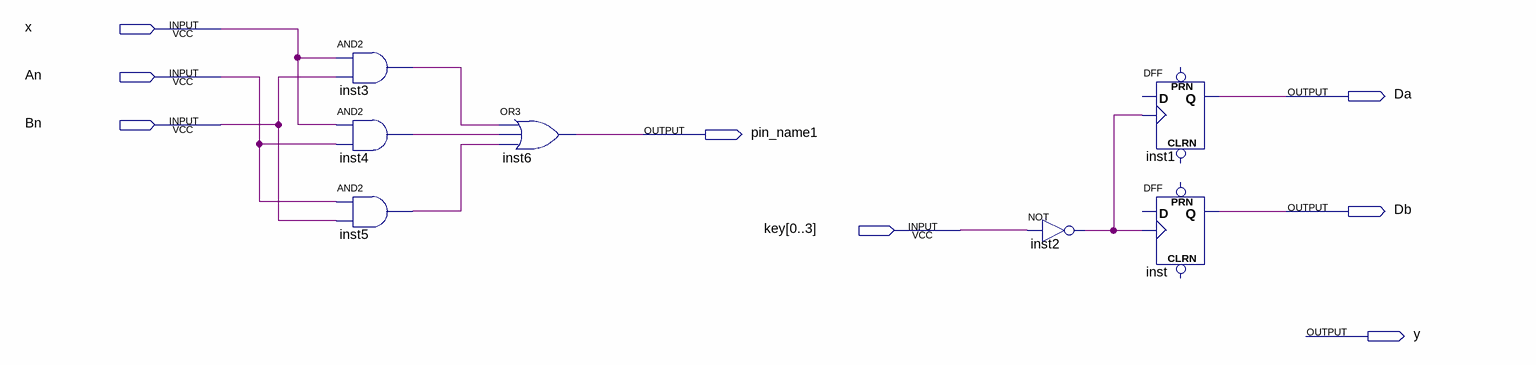
[diagram p0: schematic sheet]
// Quartus schematic FPGA_Sequential.bdf as structural Verilog: 7 symbols, 8 pins
module FPGA_Sequential (
  input  x,
  input  An,
  input  Bn,
  input  [0:3] key,
  output Da,
  output pin_name1,
  output Db,
  output y
);

  wire inst2_out, inst3_out, inst4_out, inst5_out, undriven;

  and inst3 (inst3_out, x, Bn);
  and inst4 (inst4_out, x, An);
  and inst5 (inst5_out, An, Bn);
  or inst6 (pin_name1, inst3_out, inst4_out, inst5_out);
  not inst2 (inst2_out, undriven);
  DFF inst1 (.CLK(inst2_out), .Q(Da));  // open: CLRN, D, PRN
  DFF inst (.CLK(inst2_out), .Q(Db));  // open: CLRN, D, PRN
endmodule
